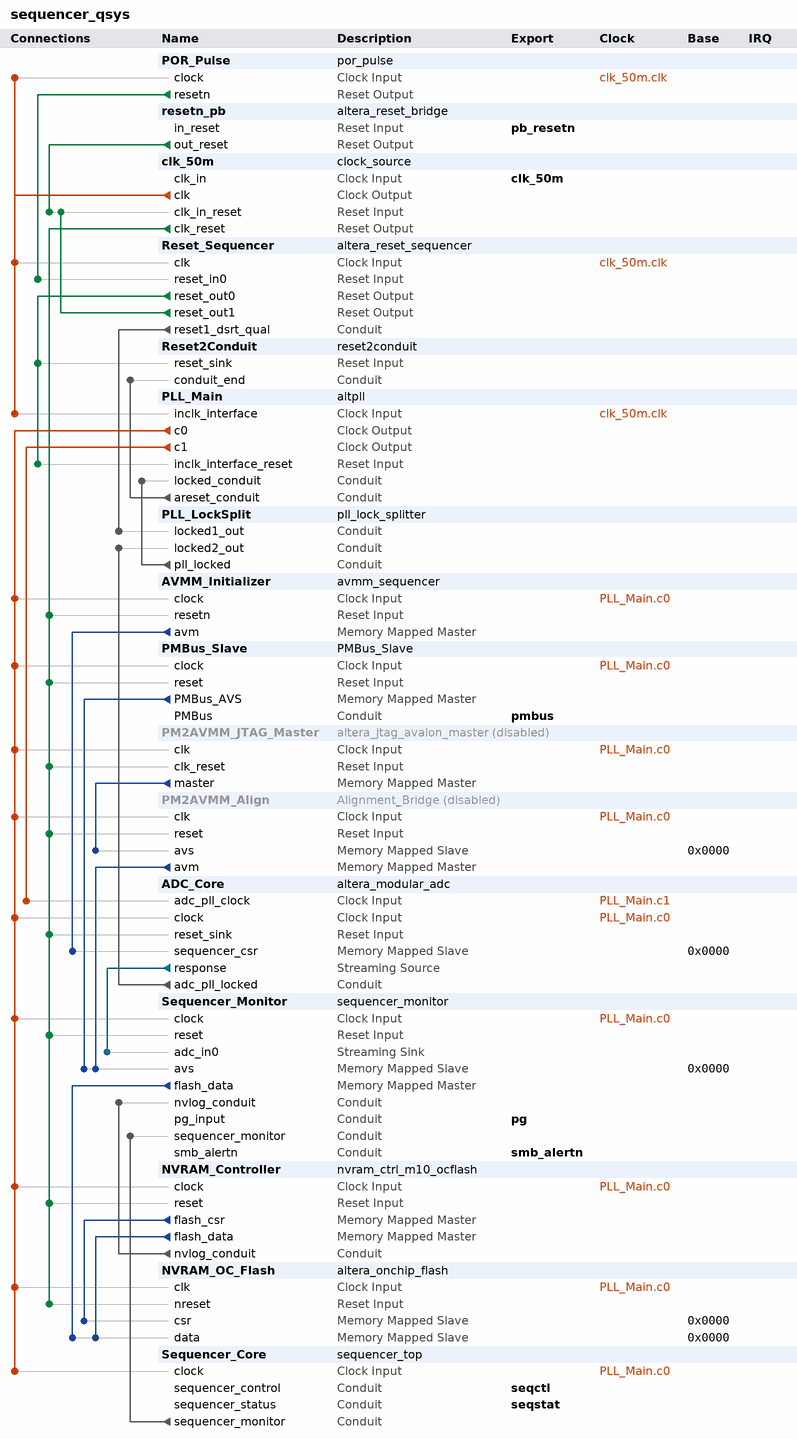
[diagram p0: system contents]
# Platform Designer (Qsys) system sequencer_qsys, MAX 10 10M08SAE144C8G
# Parameters at their usual value, and those the tool derives, are not listed.
package require -exact qsys 25.1
create_system sequencer_qsys
set_project_property DEVICE_FAMILY {MAX 10}
set_project_property DEVICE 10M08SAE144C8G

add_instance POR_Pulse por_pulse 1.0
set_instance_parameter_value POR_Pulse P_WIDTH 16

add_instance resetn_pb altera_reset_bridge 25.1
set_instance_parameter_value resetn_pb ACTIVE_LOW_RESET 1
set_instance_parameter_value resetn_pb SYNCHRONOUS_EDGES none

add_instance clk_50m clock_source 25.1
set_instance_parameter_value clk_50m clockFrequency 50000000

add_instance Reset_Sequencer altera_reset_sequencer 25.1
set_instance_parameter_value Reset_Sequencer ENABLE_CSR 0
set_instance_parameter_value Reset_Sequencer ENABLE_RESET_REQUEST_INPUT 0
set_instance_parameter_value Reset_Sequencer LIST_ASRT_DELAY 0,0,0,0,0,0,0,0,0,0
set_instance_parameter_value Reset_Sequencer LIST_ASRT_SEQ 0,1,2,3,4,5,6,7,8,9
set_instance_parameter_value Reset_Sequencer LIST_DSRT_DELAY 0,128,0,0,0,0,0,0,0,0
set_instance_parameter_value Reset_Sequencer LIST_DSRT_SEQ 0,1,2,3,4,5,6,7,8,9
set_instance_parameter_value Reset_Sequencer MIN_ASRT_TIME 1
set_instance_parameter_value Reset_Sequencer NUM_INPUTS 1
set_instance_parameter_value Reset_Sequencer NUM_OUTPUTS 2
set_instance_parameter_value Reset_Sequencer USE_DSRT_QUAL 0,1,0,0,0,0,0,0,0,0

add_instance Reset2Conduit reset2conduit 1.0

add_instance PLL_Main altpll 25.1
set_instance_parameter_value PLL_Main CLK0_DIVIDE_BY 1
set_instance_parameter_value PLL_Main CLK0_MULTIPLY_BY 1
set_instance_parameter_value PLL_Main CLK1_DIVIDE_BY 5
set_instance_parameter_value PLL_Main CLK1_DUTY_CYCLE 50
set_instance_parameter_value PLL_Main CLK1_MULTIPLY_BY 1
set_instance_parameter_value PLL_Main CLK1_PHASE_SHIFT 0
set_instance_parameter_value PLL_Main INCLK0_INPUT_FREQUENCY 20000
set_instance_parameter_value PLL_Main PORT_ARESET PORT_USED
set_instance_parameter_value PLL_Main PORT_LOCKED PORT_USED
set_instance_parameter_value PLL_Main PORT_clk1 PORT_USED
set_instance_parameter_value PLL_Main PORT_clk2 PORT_UNUSED
set_instance_parameter_value PLL_Main PORT_clk3 PORT_UNUSED

add_instance PLL_LockSplit pll_lock_splitter 1.0

add_instance AVMM_Initializer avmm_sequencer 1.0
set_instance_parameter_value AVMM_Initializer P_ADDRSIZE 8
set_instance_parameter_value AVMM_Initializer P_DATASIZE 32

add_instance PMBus_Slave PMBus_Slave 1.0
set_instance_parameter_value PMBus_Slave MAX_BYTES 4
set_instance_parameter_value PMBus_Slave PMB_SLAVE_ADDR 85

add_instance PM2AVMM_JTAG_Master altera_jtag_avalon_master 25.1
set_instance_property PM2AVMM_JTAG_Master ENABLED false

add_instance PM2AVMM_Align Alignment_Bridge 1.0
set_instance_property PM2AVMM_Align ENABLED false

add_instance ADC_Core altera_modular_adc 25.1
set_instance_parameter_value ADC_Core CLOCK_FREQ 50000000
set_instance_parameter_value ADC_Core CORE_VAR 2
set_instance_parameter_value ADC_Core DEVICE_PART 10M08SAE144C8G
set_instance_parameter_value ADC_Core clkdiv 2
set_instance_parameter_value ADC_Core enable_usr_sim 1
set_instance_parameter_value ADC_Core int_vref_vr 3.3
set_instance_parameter_value ADC_Core refsel 0
set_instance_parameter_value ADC_Core sample_rate 0
set_instance_parameter_value ADC_Core seq_order_length 7
set_instance_parameter_value ADC_Core seq_order_slot_1 1
set_instance_parameter_value ADC_Core seq_order_slot_2 2
set_instance_parameter_value ADC_Core seq_order_slot_3 3
set_instance_parameter_value ADC_Core seq_order_slot_4 4
set_instance_parameter_value ADC_Core seq_order_slot_5 5
set_instance_parameter_value ADC_Core seq_order_slot_6 6
set_instance_parameter_value ADC_Core seq_order_slot_7 8
set_instance_parameter_value ADC_Core seq_order_slot_8 7
set_instance_parameter_value ADC_Core simfilename_ch0 adcsim_ch0.txt
set_instance_parameter_value ADC_Core simfilename_ch1 adcsim_ch1.txt
set_instance_parameter_value ADC_Core simfilename_ch2 adcsim_ch2.txt
set_instance_parameter_value ADC_Core simfilename_ch3 adcsim_ch3.txt
set_instance_parameter_value ADC_Core simfilename_ch4 adcsim_ch4.txt
set_instance_parameter_value ADC_Core simfilename_ch5 adcsim_ch5.txt
set_instance_parameter_value ADC_Core simfilename_ch6 adcsim_ch6.txt
set_instance_parameter_value ADC_Core simfilename_ch7 adcsim_ch7.txt
set_instance_parameter_value ADC_Core simfilename_ch8 adcsim_ch8.txt
set_instance_parameter_value ADC_Core use_ch0 false
set_instance_parameter_value ADC_Core use_ch2 true
set_instance_parameter_value ADC_Core use_ch3 true
set_instance_parameter_value ADC_Core use_ch4 true
set_instance_parameter_value ADC_Core use_ch5 true
set_instance_parameter_value ADC_Core use_ch6 true
set_instance_parameter_value ADC_Core use_ch7 true
set_instance_parameter_value ADC_Core use_ch8 true
set_instance_parameter_value ADC_Core use_tsd false

add_instance Sequencer_Monitor sequencer_monitor 1.0
set_instance_parameter_value Sequencer_Monitor ADC_CHANNEL_IFNUM 1,1,1,1,1,1,PG_Input,PG_Input,PG_Input,PG_Input,PG_Input,PG_Input,PG_Input,PG_Input,PG_Input,PG_Input,PG_Input,PG_Input,PG_Input,PG_Input,PG_Input,PG_Input,PG_Input,PG_Input,PG_Input,PG_Input,PG_Input,PG_Input,PG_Input,PG_Input,PG_Input,PG_Input,PG_Input,PG_Input,PG_Input,PG_Input,PG_Input,PG_Input,PG_Input,PG_Input,PG_Input,PG_Input,PG_Input,PG_Input,PG_Input,PG_Input,PG_Input,PG_Input,PG_Input,PG_Input,PG_Input,PG_Input,PG_Input,PG_Input,PG_Input,PG_Input,PG_Input,PG_Input,PG_Input,PG_Input,PG_Input,PG_Input,PG_Input,PG_Input,PG_Input,PG_Input,PG_Input,PG_Input,PG_Input,PG_Input,PG_Input,PG_Input,PG_Input,PG_Input,PG_Input,PG_Input,PG_Input,PG_Input,PG_Input,PG_Input,PG_Input,PG_Input,PG_Input,PG_Input,PG_Input,PG_Input,PG_Input,PG_Input,PG_Input,PG_Input,PG_Input,PG_Input,PG_Input,PG_Input,PG_Input,PG_Input,PG_Input,PG_Input,PG_Input,PG_Input,PG_Input,PG_Input,PG_Input,PG_Input,PG_Input,PG_Input,PG_Input,PG_Input,PG_Input,PG_Input,PG_Input,PG_Input,PG_Input,PG_Input,PG_Input,PG_Input,PG_Input,PG_Input,PG_Input,PG_Input,PG_Input,PG_Input,PG_Input,PG_Input,PG_Input,PG_Input,PG_Input,PG_Input,PG_Input,PG_Input,PG_Input,PG_Input,PG_Input,PG_Input,PG_Input,PG_Input,PG_Input,PG_Input,PG_Input,PG_Input,PG_Input,PG_Input,PG_Input
set_instance_parameter_value Sequencer_Monitor ADC_CHANNEL_VOUTNUM 2,3,4,5,6,8,0,0,0,0,0,0,0,0,0,0,0,0,0,0,0,0,0,0,0,0,0,0,0,0,0,0,0,0,0,0,0,0,0,0,0,0,0,0,0,0,0,0,0,0,0,0,0,0,0,0,0,0,0,0,0,0,0,0,0,0,0,0,0,0,0,0,0,0,0,0,0,0,0,0,0,0,0,0,0,0,0,0,0,0,0,0,0,0,0,0,0,0,0,0,0,0,0,0,0,0,0,0,0,0,0,0,0,0,0,0,0,0,0,0,0,0,0,0,0,0,0,0,0,0,0,0,0,0,0,0,0,0,0,0,0,0,0
set_instance_parameter_value Sequencer_Monitor ADC_IFNUM 1
set_instance_parameter_value Sequencer_Monitor ADC_SAMPLES 3
set_instance_parameter_value Sequencer_Monitor ADC_VREF 2.5
set_instance_parameter_value Sequencer_Monitor CLOCK_RATE_CLK 50000000
set_instance_parameter_value Sequencer_Monitor COMPOSED_MONITOR 1
set_instance_parameter_value Sequencer_Monitor FEATURE_LEVEL 2
set_instance_parameter_value Sequencer_Monitor LOGGING_ENA 0
set_instance_parameter_value Sequencer_Monitor LOGGING_LEVEL 2
set_instance_parameter_value Sequencer_Monitor NV_AWIDTH 17
set_instance_parameter_value Sequencer_Monitor PG_DEBOUNCE 10
set_instance_parameter_value Sequencer_Monitor PG_NUM 7
set_instance_parameter_value Sequencer_Monitor RETRY_ATTEMPTS 3
set_instance_parameter_value Sequencer_Monitor RETRY_TIMEOUT 1
set_instance_parameter_value Sequencer_Monitor T_REQUIRE_WE_FOR_CLR false
set_instance_parameter_value Sequencer_Monitor VIN_ADC_CHANNEL 1
set_instance_parameter_value Sequencer_Monitor VIN_ADC_IFNUM 1
set_instance_parameter_value Sequencer_Monitor VIN_OFF 90.0
set_instance_parameter_value Sequencer_Monitor VIN_ON 95.0
set_instance_parameter_value Sequencer_Monitor VIN_OVF 107.0
set_instance_parameter_value Sequencer_Monitor VIN_OVRSP true
set_instance_parameter_value Sequencer_Monitor VIN_OVW 105.0
set_instance_parameter_value Sequencer_Monitor VIN_TYP 1.65
set_instance_parameter_value Sequencer_Monitor VIN_UVF 93.0
set_instance_parameter_value Sequencer_Monitor VIN_UVRSP true
set_instance_parameter_value Sequencer_Monitor VIN_UVW 97.0
set_instance_parameter_value Sequencer_Monitor VOUT0_OFF 90.0
set_instance_parameter_value Sequencer_Monitor VOUT0_ON 95.0
set_instance_parameter_value Sequencer_Monitor VOUT0_OVF 107.0
set_instance_parameter_value Sequencer_Monitor VOUT0_OVRSP true
set_instance_parameter_value Sequencer_Monitor VOUT0_OVW 105.0
set_instance_parameter_value Sequencer_Monitor VOUT0_TYP 0.6
set_instance_parameter_value Sequencer_Monitor VOUT0_UVF 93.0
set_instance_parameter_value Sequencer_Monitor VOUT0_UVRSP true
set_instance_parameter_value Sequencer_Monitor VOUT0_UVW 97.0
set_instance_parameter_value Sequencer_Monitor VOUT100_OFF 90.0
set_instance_parameter_value Sequencer_Monitor VOUT100_ON 95.0
set_instance_parameter_value Sequencer_Monitor VOUT100_OVF 107.0
set_instance_parameter_value Sequencer_Monitor VOUT100_OVRSP true
set_instance_parameter_value Sequencer_Monitor VOUT100_OVW 105.0
set_instance_parameter_value Sequencer_Monitor VOUT100_TYP 1.5
set_instance_parameter_value Sequencer_Monitor VOUT100_UVF 93.0
set_instance_parameter_value Sequencer_Monitor VOUT100_UVRSP true
set_instance_parameter_value Sequencer_Monitor VOUT100_UVW 97.0
set_instance_parameter_value Sequencer_Monitor VOUT101_OFF 90.0
set_instance_parameter_value Sequencer_Monitor VOUT101_ON 95.0
set_instance_parameter_value Sequencer_Monitor VOUT101_OVF 107.0
set_instance_parameter_value Sequencer_Monitor VOUT101_OVRSP true
set_instance_parameter_value Sequencer_Monitor VOUT101_OVW 105.0
set_instance_parameter_value Sequencer_Monitor VOUT101_TYP 1.5
set_instance_parameter_value Sequencer_Monitor VOUT101_UVF 93.0
set_instance_parameter_value Sequencer_Monitor VOUT101_UVRSP true
set_instance_parameter_value Sequencer_Monitor VOUT101_UVW 97.0
set_instance_parameter_value Sequencer_Monitor VOUT102_OFF 90.0
set_instance_parameter_value Sequencer_Monitor VOUT102_ON 95.0
set_instance_parameter_value Sequencer_Monitor VOUT102_OVF 107.0
set_instance_parameter_value Sequencer_Monitor VOUT102_OVRSP true
set_instance_parameter_value Sequencer_Monitor VOUT102_OVW 105.0
set_instance_parameter_value Sequencer_Monitor VOUT102_TYP 1.5
set_instance_parameter_value Sequencer_Monitor VOUT102_UVF 93.0
set_instance_parameter_value Sequencer_Monitor VOUT102_UVRSP true
set_instance_parameter_value Sequencer_Monitor VOUT102_UVW 97.0
set_instance_parameter_value Sequencer_Monitor VOUT103_OFF 90.0
set_instance_parameter_value Sequencer_Monitor VOUT103_ON 95.0
set_instance_parameter_value Sequencer_Monitor VOUT103_OVF 107.0
set_instance_parameter_value Sequencer_Monitor VOUT103_OVRSP true
set_instance_parameter_value Sequencer_Monitor VOUT103_OVW 105.0
set_instance_parameter_value Sequencer_Monitor VOUT103_TYP 1.5
set_instance_parameter_value Sequencer_Monitor VOUT103_UVF 93.0
set_instance_parameter_value Sequencer_Monitor VOUT103_UVRSP true
set_instance_parameter_value Sequencer_Monitor VOUT103_UVW 97.0
set_instance_parameter_value Sequencer_Monitor VOUT104_OFF 90.0
set_instance_parameter_value Sequencer_Monitor VOUT104_ON 95.0
set_instance_parameter_value Sequencer_Monitor VOUT104_OVF 107.0
set_instance_parameter_value Sequencer_Monitor VOUT104_OVRSP true
set_instance_parameter_value Sequencer_Monitor VOUT104_OVW 105.0
set_instance_parameter_value Sequencer_Monitor VOUT104_TYP 1.5
set_instance_parameter_value Sequencer_Monitor VOUT104_UVF 93.0
set_instance_parameter_value Sequencer_Monitor VOUT104_UVRSP true
set_instance_parameter_value Sequencer_Monitor VOUT104_UVW 97.0
set_instance_parameter_value Sequencer_Monitor VOUT105_OFF 90.0
set_instance_parameter_value Sequencer_Monitor VOUT105_ON 95.0
set_instance_parameter_value Sequencer_Monitor VOUT105_OVF 107.0
set_instance_parameter_value Sequencer_Monitor VOUT105_OVRSP true
set_instance_parameter_value Sequencer_Monitor VOUT105_OVW 105.0
set_instance_parameter_value Sequencer_Monitor VOUT105_TYP 1.5
set_instance_parameter_value Sequencer_Monitor VOUT105_UVF 93.0
set_instance_parameter_value Sequencer_Monitor VOUT105_UVRSP true
set_instance_parameter_value Sequencer_Monitor VOUT105_UVW 97.0
set_instance_parameter_value Sequencer_Monitor VOUT106_OFF 90.0
set_instance_parameter_value Sequencer_Monitor VOUT106_ON 95.0
set_instance_parameter_value Sequencer_Monitor VOUT106_OVF 107.0
set_instance_parameter_value Sequencer_Monitor VOUT106_OVRSP true
set_instance_parameter_value Sequencer_Monitor VOUT106_OVW 105.0
set_instance_parameter_value Sequencer_Monitor VOUT106_TYP 1.5
set_instance_parameter_value Sequencer_Monitor VOUT106_UVF 93.0
set_instance_parameter_value Sequencer_Monitor VOUT106_UVRSP true
set_instance_parameter_value Sequencer_Monitor VOUT106_UVW 97.0
set_instance_parameter_value Sequencer_Monitor VOUT107_OFF 90.0
set_instance_parameter_value Sequencer_Monitor VOUT107_ON 95.0
set_instance_parameter_value Sequencer_Monitor VOUT107_OVF 107.0
set_instance_parameter_value Sequencer_Monitor VOUT107_OVRSP true
set_instance_parameter_value Sequencer_Monitor VOUT107_OVW 105.0
set_instance_parameter_value Sequencer_Monitor VOUT107_TYP 1.5
set_instance_parameter_value Sequencer_Monitor VOUT107_UVF 93.0
set_instance_parameter_value Sequencer_Monitor VOUT107_UVRSP true
set_instance_parameter_value Sequencer_Monitor VOUT107_UVW 97.0
set_instance_parameter_value Sequencer_Monitor VOUT108_OFF 90.0
set_instance_parameter_value Sequencer_Monitor VOUT108_ON 95.0
set_instance_parameter_value Sequencer_Monitor VOUT108_OVF 107.0
set_instance_parameter_value Sequencer_Monitor VOUT108_OVRSP true
set_instance_parameter_value Sequencer_Monitor VOUT108_OVW 105.0
set_instance_parameter_value Sequencer_Monitor VOUT108_TYP 1.5
set_instance_parameter_value Sequencer_Monitor VOUT108_UVF 93.0
set_instance_parameter_value Sequencer_Monitor VOUT108_UVRSP true
set_instance_parameter_value Sequencer_Monitor VOUT108_UVW 97.0
set_instance_parameter_value Sequencer_Monitor VOUT109_OFF 90.0
set_instance_parameter_value Sequencer_Monitor VOUT109_ON 95.0
set_instance_parameter_value Sequencer_Monitor VOUT109_OVF 107.0
set_instance_parameter_value Sequencer_Monitor VOUT109_OVRSP true
set_instance_parameter_value Sequencer_Monitor VOUT109_OVW 105.0
set_instance_parameter_value Sequencer_Monitor VOUT109_TYP 1.5
set_instance_parameter_value Sequencer_Monitor VOUT109_UVF 93.0
set_instance_parameter_value Sequencer_Monitor VOUT109_UVRSP true
set_instance_parameter_value Sequencer_Monitor VOUT109_UVW 97.0
set_instance_parameter_value Sequencer_Monitor VOUT10_OFF 90.0
set_instance_parameter_value Sequencer_Monitor VOUT10_ON 95.0
set_instance_parameter_value Sequencer_Monitor VOUT10_OVF 107.0
set_instance_parameter_value Sequencer_Monitor VOUT10_OVRSP true
set_instance_parameter_value Sequencer_Monitor VOUT10_OVW 105.0
set_instance_parameter_value Sequencer_Monitor VOUT10_TYP 1.5
set_instance_parameter_value Sequencer_Monitor VOUT10_UVF 93.0
set_instance_parameter_value Sequencer_Monitor VOUT10_UVRSP true
set_instance_parameter_value Sequencer_Monitor VOUT10_UVW 97.0
set_instance_parameter_value Sequencer_Monitor VOUT110_OFF 90.0
set_instance_parameter_value Sequencer_Monitor VOUT110_ON 95.0
set_instance_parameter_value Sequencer_Monitor VOUT110_OVF 107.0
set_instance_parameter_value Sequencer_Monitor VOUT110_OVRSP true
set_instance_parameter_value Sequencer_Monitor VOUT110_OVW 105.0
set_instance_parameter_value Sequencer_Monitor VOUT110_TYP 1.5
set_instance_parameter_value Sequencer_Monitor VOUT110_UVF 93.0
set_instance_parameter_value Sequencer_Monitor VOUT110_UVRSP true
set_instance_parameter_value Sequencer_Monitor VOUT110_UVW 97.0
set_instance_parameter_value Sequencer_Monitor VOUT111_OFF 90.0
set_instance_parameter_value Sequencer_Monitor VOUT111_ON 95.0
set_instance_parameter_value Sequencer_Monitor VOUT111_OVF 107.0
set_instance_parameter_value Sequencer_Monitor VOUT111_OVRSP true
set_instance_parameter_value Sequencer_Monitor VOUT111_OVW 105.0
set_instance_parameter_value Sequencer_Monitor VOUT111_TYP 1.5
set_instance_parameter_value Sequencer_Monitor VOUT111_UVF 93.0
set_instance_parameter_value Sequencer_Monitor VOUT111_UVRSP true
set_instance_parameter_value Sequencer_Monitor VOUT111_UVW 97.0
set_instance_parameter_value Sequencer_Monitor VOUT112_OFF 90.0
set_instance_parameter_value Sequencer_Monitor VOUT112_ON 95.0
set_instance_parameter_value Sequencer_Monitor VOUT112_OVF 107.0
set_instance_parameter_value Sequencer_Monitor VOUT112_OVRSP true
set_instance_parameter_value Sequencer_Monitor VOUT112_OVW 105.0
set_instance_parameter_value Sequencer_Monitor VOUT112_TYP 1.5
set_instance_parameter_value Sequencer_Monitor VOUT112_UVF 93.0
set_instance_parameter_value Sequencer_Monitor VOUT112_UVRSP true
set_instance_parameter_value Sequencer_Monitor VOUT112_UVW 97.0
set_instance_parameter_value Sequencer_Monitor VOUT113_OFF 90.0
set_instance_parameter_value Sequencer_Monitor VOUT113_ON 95.0
set_instance_parameter_value Sequencer_Monitor VOUT113_OVF 107.0
set_instance_parameter_value Sequencer_Monitor VOUT113_OVRSP true
set_instance_parameter_value Sequencer_Monitor VOUT113_OVW 105.0
set_instance_parameter_value Sequencer_Monitor VOUT113_TYP 1.5
set_instance_parameter_value Sequencer_Monitor VOUT113_UVF 93.0
set_instance_parameter_value Sequencer_Monitor VOUT113_UVRSP true
set_instance_parameter_value Sequencer_Monitor VOUT113_UVW 97.0
set_instance_parameter_value Sequencer_Monitor VOUT114_OFF 90.0
set_instance_parameter_value Sequencer_Monitor VOUT114_ON 95.0
set_instance_parameter_value Sequencer_Monitor VOUT114_OVF 107.0
set_instance_parameter_value Sequencer_Monitor VOUT114_OVRSP true
set_instance_parameter_value Sequencer_Monitor VOUT114_OVW 105.0
set_instance_parameter_value Sequencer_Monitor VOUT114_TYP 1.5
set_instance_parameter_value Sequencer_Monitor VOUT114_UVF 93.0
set_instance_parameter_value Sequencer_Monitor VOUT114_UVRSP true
set_instance_parameter_value Sequencer_Monitor VOUT114_UVW 97.0
set_instance_parameter_value Sequencer_Monitor VOUT115_OFF 90.0
set_instance_parameter_value Sequencer_Monitor VOUT115_ON 95.0
set_instance_parameter_value Sequencer_Monitor VOUT115_OVF 107.0
set_instance_parameter_value Sequencer_Monitor VOUT115_OVRSP true
set_instance_parameter_value Sequencer_Monitor VOUT115_OVW 105.0
set_instance_parameter_value Sequencer_Monitor VOUT115_TYP 1.5
set_instance_parameter_value Sequencer_Monitor VOUT115_UVF 93.0
set_instance_parameter_value Sequencer_Monitor VOUT115_UVRSP true
set_instance_parameter_value Sequencer_Monitor VOUT115_UVW 97.0
set_instance_parameter_value Sequencer_Monitor VOUT116_OFF 90.0
set_instance_parameter_value Sequencer_Monitor VOUT116_ON 95.0
set_instance_parameter_value Sequencer_Monitor VOUT116_OVF 107.0
set_instance_parameter_value Sequencer_Monitor VOUT116_OVRSP true
set_instance_parameter_value Sequencer_Monitor VOUT116_OVW 105.0
set_instance_parameter_value Sequencer_Monitor VOUT116_TYP 1.5
set_instance_parameter_value Sequencer_Monitor VOUT116_UVF 93.0
set_instance_parameter_value Sequencer_Monitor VOUT116_UVRSP true
set_instance_parameter_value Sequencer_Monitor VOUT116_UVW 97.0
set_instance_parameter_value Sequencer_Monitor VOUT117_OFF 90.0
set_instance_parameter_value Sequencer_Monitor VOUT117_ON 95.0
set_instance_parameter_value Sequencer_Monitor VOUT117_OVF 107.0
set_instance_parameter_value Sequencer_Monitor VOUT117_OVRSP true
set_instance_parameter_value Sequencer_Monitor VOUT117_OVW 105.0
set_instance_parameter_value Sequencer_Monitor VOUT117_TYP 1.5
set_instance_parameter_value Sequencer_Monitor VOUT117_UVF 93.0
set_instance_parameter_value Sequencer_Monitor VOUT117_UVRSP true
set_instance_parameter_value Sequencer_Monitor VOUT117_UVW 97.0
set_instance_parameter_value Sequencer_Monitor VOUT118_OFF 90.0
set_instance_parameter_value Sequencer_Monitor VOUT118_ON 95.0
set_instance_parameter_value Sequencer_Monitor VOUT118_OVF 107.0
set_instance_parameter_value Sequencer_Monitor VOUT118_OVRSP true
set_instance_parameter_value Sequencer_Monitor VOUT118_OVW 105.0
set_instance_parameter_value Sequencer_Monitor VOUT118_TYP 1.5
set_instance_parameter_value Sequencer_Monitor VOUT118_UVF 93.0
set_instance_parameter_value Sequencer_Monitor VOUT118_UVRSP true
set_instance_parameter_value Sequencer_Monitor VOUT118_UVW 97.0
set_instance_parameter_value Sequencer_Monitor VOUT119_OFF 90.0
set_instance_parameter_value Sequencer_Monitor VOUT119_ON 95.0
set_instance_parameter_value Sequencer_Monitor VOUT119_OVF 107.0
set_instance_parameter_value Sequencer_Monitor VOUT119_OVRSP true
set_instance_parameter_value Sequencer_Monitor VOUT119_OVW 105.0
set_instance_parameter_value Sequencer_Monitor VOUT119_TYP 1.5
set_instance_parameter_value Sequencer_Monitor VOUT119_UVF 93.0
set_instance_parameter_value Sequencer_Monitor VOUT119_UVRSP true
set_instance_parameter_value Sequencer_Monitor VOUT119_UVW 97.0
set_instance_parameter_value Sequencer_Monitor VOUT11_OFF 90.0
set_instance_parameter_value Sequencer_Monitor VOUT11_ON 95.0
set_instance_parameter_value Sequencer_Monitor VOUT11_OVF 107.0
set_instance_parameter_value Sequencer_Monitor VOUT11_OVRSP true
set_instance_parameter_value Sequencer_Monitor VOUT11_OVW 105.0
set_instance_parameter_value Sequencer_Monitor VOUT11_TYP 1.5
set_instance_parameter_value Sequencer_Monitor VOUT11_UVF 93.0
set_instance_parameter_value Sequencer_Monitor VOUT11_UVRSP true
set_instance_parameter_value Sequencer_Monitor VOUT11_UVW 97.0
set_instance_parameter_value Sequencer_Monitor VOUT120_OFF 90.0
set_instance_parameter_value Sequencer_Monitor VOUT120_ON 95.0
set_instance_parameter_value Sequencer_Monitor VOUT120_OVF 107.0
set_instance_parameter_value Sequencer_Monitor VOUT120_OVRSP true
set_instance_parameter_value Sequencer_Monitor VOUT120_OVW 105.0
set_instance_parameter_value Sequencer_Monitor VOUT120_TYP 1.5
set_instance_parameter_value Sequencer_Monitor VOUT120_UVF 93.0
set_instance_parameter_value Sequencer_Monitor VOUT120_UVRSP true
set_instance_parameter_value Sequencer_Monitor VOUT120_UVW 97.0
set_instance_parameter_value Sequencer_Monitor VOUT121_OFF 90.0
set_instance_parameter_value Sequencer_Monitor VOUT121_ON 95.0
set_instance_parameter_value Sequencer_Monitor VOUT121_OVF 107.0
set_instance_parameter_value Sequencer_Monitor VOUT121_OVRSP true
set_instance_parameter_value Sequencer_Monitor VOUT121_OVW 105.0
set_instance_parameter_value Sequencer_Monitor VOUT121_TYP 1.5
set_instance_parameter_value Sequencer_Monitor VOUT121_UVF 93.0
set_instance_parameter_value Sequencer_Monitor VOUT121_UVRSP true
set_instance_parameter_value Sequencer_Monitor VOUT121_UVW 97.0
set_instance_parameter_value Sequencer_Monitor VOUT122_OFF 90.0
set_instance_parameter_value Sequencer_Monitor VOUT122_ON 95.0
set_instance_parameter_value Sequencer_Monitor VOUT122_OVF 107.0
set_instance_parameter_value Sequencer_Monitor VOUT122_OVRSP true
set_instance_parameter_value Sequencer_Monitor VOUT122_OVW 105.0
set_instance_parameter_value Sequencer_Monitor VOUT122_TYP 1.5
set_instance_parameter_value Sequencer_Monitor VOUT122_UVF 93.0
set_instance_parameter_value Sequencer_Monitor VOUT122_UVRSP true
set_instance_parameter_value Sequencer_Monitor VOUT122_UVW 97.0
set_instance_parameter_value Sequencer_Monitor VOUT123_OFF 90.0
set_instance_parameter_value Sequencer_Monitor VOUT123_ON 95.0
set_instance_parameter_value Sequencer_Monitor VOUT123_OVF 107.0
set_instance_parameter_value Sequencer_Monitor VOUT123_OVRSP true
set_instance_parameter_value Sequencer_Monitor VOUT123_OVW 105.0
set_instance_parameter_value Sequencer_Monitor VOUT123_TYP 1.5
set_instance_parameter_value Sequencer_Monitor VOUT123_UVF 93.0
set_instance_parameter_value Sequencer_Monitor VOUT123_UVRSP true
set_instance_parameter_value Sequencer_Monitor VOUT123_UVW 97.0
set_instance_parameter_value Sequencer_Monitor VOUT124_OFF 90.0
set_instance_parameter_value Sequencer_Monitor VOUT124_ON 95.0
set_instance_parameter_value Sequencer_Monitor VOUT124_OVF 107.0
set_instance_parameter_value Sequencer_Monitor VOUT124_OVRSP true
set_instance_parameter_value Sequencer_Monitor VOUT124_OVW 105.0
set_instance_parameter_value Sequencer_Monitor VOUT124_TYP 1.5
set_instance_parameter_value Sequencer_Monitor VOUT124_UVF 93.0
set_instance_parameter_value Sequencer_Monitor VOUT124_UVRSP true
set_instance_parameter_value Sequencer_Monitor VOUT124_UVW 97.0
set_instance_parameter_value Sequencer_Monitor VOUT125_OFF 90.0
set_instance_parameter_value Sequencer_Monitor VOUT125_ON 95.0
set_instance_parameter_value Sequencer_Monitor VOUT125_OVF 107.0
set_instance_parameter_value Sequencer_Monitor VOUT125_OVRSP true
set_instance_parameter_value Sequencer_Monitor VOUT125_OVW 105.0
set_instance_parameter_value Sequencer_Monitor VOUT125_TYP 1.5
set_instance_parameter_value Sequencer_Monitor VOUT125_UVF 93.0
set_instance_parameter_value Sequencer_Monitor VOUT125_UVRSP true
set_instance_parameter_value Sequencer_Monitor VOUT125_UVW 97.0
set_instance_parameter_value Sequencer_Monitor VOUT126_OFF 90.0
set_instance_parameter_value Sequencer_Monitor VOUT126_ON 95.0
set_instance_parameter_value Sequencer_Monitor VOUT126_OVF 107.0
set_instance_parameter_value Sequencer_Monitor VOUT126_OVRSP true
set_instance_parameter_value Sequencer_Monitor VOUT126_OVW 105.0
set_instance_parameter_value Sequencer_Monitor VOUT126_TYP 1.5
set_instance_parameter_value Sequencer_Monitor VOUT126_UVF 93.0
set_instance_parameter_value Sequencer_Monitor VOUT126_UVRSP true
set_instance_parameter_value Sequencer_Monitor VOUT126_UVW 97.0
set_instance_parameter_value Sequencer_Monitor VOUT127_OFF 90.0
set_instance_parameter_value Sequencer_Monitor VOUT127_ON 95.0
set_instance_parameter_value Sequencer_Monitor VOUT127_OVF 107.0
set_instance_parameter_value Sequencer_Monitor VOUT127_OVRSP true
set_instance_parameter_value Sequencer_Monitor VOUT127_OVW 105.0
set_instance_parameter_value Sequencer_Monitor VOUT127_TYP 1.5
set_instance_parameter_value Sequencer_Monitor VOUT127_UVF 93.0
set_instance_parameter_value Sequencer_Monitor VOUT127_UVRSP true
set_instance_parameter_value Sequencer_Monitor VOUT127_UVW 97.0
set_instance_parameter_value Sequencer_Monitor VOUT128_OFF 90.0
set_instance_parameter_value Sequencer_Monitor VOUT128_ON 95.0
set_instance_parameter_value Sequencer_Monitor VOUT128_OVF 107.0
set_instance_parameter_value Sequencer_Monitor VOUT128_OVRSP true
set_instance_parameter_value Sequencer_Monitor VOUT128_OVW 105.0
set_instance_parameter_value Sequencer_Monitor VOUT128_TYP 1.5
set_instance_parameter_value Sequencer_Monitor VOUT128_UVF 93.0
set_instance_parameter_value Sequencer_Monitor VOUT128_UVRSP true
set_instance_parameter_value Sequencer_Monitor VOUT128_UVW 97.0
set_instance_parameter_value Sequencer_Monitor VOUT129_OFF 90.0
set_instance_parameter_value Sequencer_Monitor VOUT129_ON 95.0
set_instance_parameter_value Sequencer_Monitor VOUT129_OVF 107.0
set_instance_parameter_value Sequencer_Monitor VOUT129_OVRSP true
set_instance_parameter_value Sequencer_Monitor VOUT129_OVW 105.0
set_instance_parameter_value Sequencer_Monitor VOUT129_TYP 1.5
set_instance_parameter_value Sequencer_Monitor VOUT129_UVF 93.0
set_instance_parameter_value Sequencer_Monitor VOUT129_UVRSP true
set_instance_parameter_value Sequencer_Monitor VOUT129_UVW 97.0
set_instance_parameter_value Sequencer_Monitor VOUT12_OFF 90.0
set_instance_parameter_value Sequencer_Monitor VOUT12_ON 95.0
set_instance_parameter_value Sequencer_Monitor VOUT12_OVF 107.0
set_instance_parameter_value Sequencer_Monitor VOUT12_OVRSP true
set_instance_parameter_value Sequencer_Monitor VOUT12_OVW 105.0
set_instance_parameter_value Sequencer_Monitor VOUT12_TYP 1.5
set_instance_parameter_value Sequencer_Monitor VOUT12_UVF 93.0
set_instance_parameter_value Sequencer_Monitor VOUT12_UVRSP true
set_instance_parameter_value Sequencer_Monitor VOUT12_UVW 97.0
set_instance_parameter_value Sequencer_Monitor VOUT130_OFF 90.0
set_instance_parameter_value Sequencer_Monitor VOUT130_ON 95.0
set_instance_parameter_value Sequencer_Monitor VOUT130_OVF 107.0
set_instance_parameter_value Sequencer_Monitor VOUT130_OVRSP true
set_instance_parameter_value Sequencer_Monitor VOUT130_OVW 105.0
set_instance_parameter_value Sequencer_Monitor VOUT130_TYP 1.5
set_instance_parameter_value Sequencer_Monitor VOUT130_UVF 93.0
set_instance_parameter_value Sequencer_Monitor VOUT130_UVRSP true
set_instance_parameter_value Sequencer_Monitor VOUT130_UVW 97.0
set_instance_parameter_value Sequencer_Monitor VOUT131_OFF 90.0
set_instance_parameter_value Sequencer_Monitor VOUT131_ON 95.0
set_instance_parameter_value Sequencer_Monitor VOUT131_OVF 107.0
set_instance_parameter_value Sequencer_Monitor VOUT131_OVRSP true
set_instance_parameter_value Sequencer_Monitor VOUT131_OVW 105.0
set_instance_parameter_value Sequencer_Monitor VOUT131_TYP 1.5
set_instance_parameter_value Sequencer_Monitor VOUT131_UVF 93.0
set_instance_parameter_value Sequencer_Monitor VOUT131_UVRSP true
set_instance_parameter_value Sequencer_Monitor VOUT131_UVW 97.0
set_instance_parameter_value Sequencer_Monitor VOUT132_OFF 90.0
set_instance_parameter_value Sequencer_Monitor VOUT132_ON 95.0
set_instance_parameter_value Sequencer_Monitor VOUT132_OVF 107.0
set_instance_parameter_value Sequencer_Monitor VOUT132_OVRSP true
set_instance_parameter_value Sequencer_Monitor VOUT132_OVW 105.0
set_instance_parameter_value Sequencer_Monitor VOUT132_TYP 1.5
set_instance_parameter_value Sequencer_Monitor VOUT132_UVF 93.0
set_instance_parameter_value Sequencer_Monitor VOUT132_UVRSP true
set_instance_parameter_value Sequencer_Monitor VOUT132_UVW 97.0
set_instance_parameter_value Sequencer_Monitor VOUT133_OFF 90.0
set_instance_parameter_value Sequencer_Monitor VOUT133_ON 95.0
set_instance_parameter_value Sequencer_Monitor VOUT133_OVF 107.0
set_instance_parameter_value Sequencer_Monitor VOUT133_OVRSP true
set_instance_parameter_value Sequencer_Monitor VOUT133_OVW 105.0
set_instance_parameter_value Sequencer_Monitor VOUT133_TYP 1.5
set_instance_parameter_value Sequencer_Monitor VOUT133_UVF 93.0
set_instance_parameter_value Sequencer_Monitor VOUT133_UVRSP true
set_instance_parameter_value Sequencer_Monitor VOUT133_UVW 97.0
set_instance_parameter_value Sequencer_Monitor VOUT134_OFF 90.0
set_instance_parameter_value Sequencer_Monitor VOUT134_ON 95.0
set_instance_parameter_value Sequencer_Monitor VOUT134_OVF 107.0
set_instance_parameter_value Sequencer_Monitor VOUT134_OVRSP true
set_instance_parameter_value Sequencer_Monitor VOUT134_OVW 105.0
set_instance_parameter_value Sequencer_Monitor VOUT134_TYP 1.5
set_instance_parameter_value Sequencer_Monitor VOUT134_UVF 93.0
set_instance_parameter_value Sequencer_Monitor VOUT134_UVRSP true
set_instance_parameter_value Sequencer_Monitor VOUT134_UVW 97.0
set_instance_parameter_value Sequencer_Monitor VOUT135_OFF 90.0
set_instance_parameter_value Sequencer_Monitor VOUT135_ON 95.0
set_instance_parameter_value Sequencer_Monitor VOUT135_OVF 107.0
set_instance_parameter_value Sequencer_Monitor VOUT135_OVRSP true
set_instance_parameter_value Sequencer_Monitor VOUT135_OVW 105.0
set_instance_parameter_value Sequencer_Monitor VOUT135_TYP 1.5
set_instance_parameter_value Sequencer_Monitor VOUT135_UVF 93.0
set_instance_parameter_value Sequencer_Monitor VOUT135_UVRSP true
set_instance_parameter_value Sequencer_Monitor VOUT135_UVW 97.0
set_instance_parameter_value Sequencer_Monitor VOUT136_OFF 90.0
set_instance_parameter_value Sequencer_Monitor VOUT136_ON 95.0
set_instance_parameter_value Sequencer_Monitor VOUT136_OVF 107.0
set_instance_parameter_value Sequencer_Monitor VOUT136_OVRSP true
set_instance_parameter_value Sequencer_Monitor VOUT136_OVW 105.0
set_instance_parameter_value Sequencer_Monitor VOUT136_TYP 1.5
set_instance_parameter_value Sequencer_Monitor VOUT136_UVF 93.0
set_instance_parameter_value Sequencer_Monitor VOUT136_UVRSP true
set_instance_parameter_value Sequencer_Monitor VOUT136_UVW 97.0
set_instance_parameter_value Sequencer_Monitor VOUT137_OFF 90.0
set_instance_parameter_value Sequencer_Monitor VOUT137_ON 95.0
set_instance_parameter_value Sequencer_Monitor VOUT137_OVF 107.0
set_instance_parameter_value Sequencer_Monitor VOUT137_OVRSP true
set_instance_parameter_value Sequencer_Monitor VOUT137_OVW 105.0
set_instance_parameter_value Sequencer_Monitor VOUT137_TYP 1.5
set_instance_parameter_value Sequencer_Monitor VOUT137_UVF 93.0
set_instance_parameter_value Sequencer_Monitor VOUT137_UVRSP true
set_instance_parameter_value Sequencer_Monitor VOUT137_UVW 97.0
set_instance_parameter_value Sequencer_Monitor VOUT138_OFF 90.0
set_instance_parameter_value Sequencer_Monitor VOUT138_ON 95.0
set_instance_parameter_value Sequencer_Monitor VOUT138_OVF 107.0
set_instance_parameter_value Sequencer_Monitor VOUT138_OVRSP true
set_instance_parameter_value Sequencer_Monitor VOUT138_OVW 105.0
set_instance_parameter_value Sequencer_Monitor VOUT138_TYP 1.5
set_instance_parameter_value Sequencer_Monitor VOUT138_UVF 93.0
set_instance_parameter_value Sequencer_Monitor VOUT138_UVRSP true
set_instance_parameter_value Sequencer_Monitor VOUT138_UVW 97.0
set_instance_parameter_value Sequencer_Monitor VOUT139_OFF 90.0
set_instance_parameter_value Sequencer_Monitor VOUT139_ON 95.0
set_instance_parameter_value Sequencer_Monitor VOUT139_OVF 107.0
set_instance_parameter_value Sequencer_Monitor VOUT139_OVRSP true
set_instance_parameter_value Sequencer_Monitor VOUT139_OVW 105.0
set_instance_parameter_value Sequencer_Monitor VOUT139_TYP 1.5
set_instance_parameter_value Sequencer_Monitor VOUT139_UVF 93.0
set_instance_parameter_value Sequencer_Monitor VOUT139_UVRSP true
set_instance_parameter_value Sequencer_Monitor VOUT139_UVW 97.0
set_instance_parameter_value Sequencer_Monitor VOUT13_OFF 90.0
set_instance_parameter_value Sequencer_Monitor VOUT13_ON 95.0
set_instance_parameter_value Sequencer_Monitor VOUT13_OVF 107.0
set_instance_parameter_value Sequencer_Monitor VOUT13_OVRSP true
set_instance_parameter_value Sequencer_Monitor VOUT13_OVW 105.0
set_instance_parameter_value Sequencer_Monitor VOUT13_TYP 1.5
set_instance_parameter_value Sequencer_Monitor VOUT13_UVF 93.0
set_instance_parameter_value Sequencer_Monitor VOUT13_UVRSP true
set_instance_parameter_value Sequencer_Monitor VOUT13_UVW 97.0
set_instance_parameter_value Sequencer_Monitor VOUT140_OFF 90.0
set_instance_parameter_value Sequencer_Monitor VOUT140_ON 95.0
set_instance_parameter_value Sequencer_Monitor VOUT140_OVF 107.0
set_instance_parameter_value Sequencer_Monitor VOUT140_OVRSP true
set_instance_parameter_value Sequencer_Monitor VOUT140_OVW 105.0
set_instance_parameter_value Sequencer_Monitor VOUT140_TYP 1.5
set_instance_parameter_value Sequencer_Monitor VOUT140_UVF 93.0
set_instance_parameter_value Sequencer_Monitor VOUT140_UVRSP true
set_instance_parameter_value Sequencer_Monitor VOUT140_UVW 97.0
set_instance_parameter_value Sequencer_Monitor VOUT141_OFF 90.0
set_instance_parameter_value Sequencer_Monitor VOUT141_ON 95.0
set_instance_parameter_value Sequencer_Monitor VOUT141_OVF 107.0
set_instance_parameter_value Sequencer_Monitor VOUT141_OVRSP true
set_instance_parameter_value Sequencer_Monitor VOUT141_OVW 105.0
set_instance_parameter_value Sequencer_Monitor VOUT141_TYP 1.5
set_instance_parameter_value Sequencer_Monitor VOUT141_UVF 93.0
set_instance_parameter_value Sequencer_Monitor VOUT141_UVRSP true
set_instance_parameter_value Sequencer_Monitor VOUT141_UVW 97.0
set_instance_parameter_value Sequencer_Monitor VOUT142_OFF 90.0
set_instance_parameter_value Sequencer_Monitor VOUT142_ON 95.0
set_instance_parameter_value Sequencer_Monitor VOUT142_OVF 107.0
set_instance_parameter_value Sequencer_Monitor VOUT142_OVRSP true
set_instance_parameter_value Sequencer_Monitor VOUT142_OVW 105.0
set_instance_parameter_value Sequencer_Monitor VOUT142_TYP 1.5
set_instance_parameter_value Sequencer_Monitor VOUT142_UVF 93.0
set_instance_parameter_value Sequencer_Monitor VOUT142_UVRSP true
set_instance_parameter_value Sequencer_Monitor VOUT142_UVW 97.0
set_instance_parameter_value Sequencer_Monitor VOUT14_OFF 90.0
set_instance_parameter_value Sequencer_Monitor VOUT14_ON 95.0
set_instance_parameter_value Sequencer_Monitor VOUT14_OVF 107.0
set_instance_parameter_value Sequencer_Monitor VOUT14_OVRSP true
set_instance_parameter_value Sequencer_Monitor VOUT14_OVW 105.0
set_instance_parameter_value Sequencer_Monitor VOUT14_TYP 1.5
set_instance_parameter_value Sequencer_Monitor VOUT14_UVF 93.0
set_instance_parameter_value Sequencer_Monitor VOUT14_UVRSP true
set_instance_parameter_value Sequencer_Monitor VOUT14_UVW 97.0
set_instance_parameter_value Sequencer_Monitor VOUT15_OFF 90.0
set_instance_parameter_value Sequencer_Monitor VOUT15_ON 95.0
set_instance_parameter_value Sequencer_Monitor VOUT15_OVF 107.0
set_instance_parameter_value Sequencer_Monitor VOUT15_OVRSP true
set_instance_parameter_value Sequencer_Monitor VOUT15_OVW 105.0
set_instance_parameter_value Sequencer_Monitor VOUT15_TYP 1.5
set_instance_parameter_value Sequencer_Monitor VOUT15_UVF 93.0
set_instance_parameter_value Sequencer_Monitor VOUT15_UVRSP true
set_instance_parameter_value Sequencer_Monitor VOUT15_UVW 97.0
set_instance_parameter_value Sequencer_Monitor VOUT16_OFF 90.0
set_instance_parameter_value Sequencer_Monitor VOUT16_ON 95.0
set_instance_parameter_value Sequencer_Monitor VOUT16_OVF 107.0
set_instance_parameter_value Sequencer_Monitor VOUT16_OVRSP true
set_instance_parameter_value Sequencer_Monitor VOUT16_OVW 105.0
set_instance_parameter_value Sequencer_Monitor VOUT16_TYP 1.5
set_instance_parameter_value Sequencer_Monitor VOUT16_UVF 93.0
set_instance_parameter_value Sequencer_Monitor VOUT16_UVRSP true
set_instance_parameter_value Sequencer_Monitor VOUT16_UVW 97.0
set_instance_parameter_value Sequencer_Monitor VOUT17_OFF 90.0
set_instance_parameter_value Sequencer_Monitor VOUT17_ON 95.0
set_instance_parameter_value Sequencer_Monitor VOUT17_OVF 107.0
set_instance_parameter_value Sequencer_Monitor VOUT17_OVRSP true
set_instance_parameter_value Sequencer_Monitor VOUT17_OVW 105.0
set_instance_parameter_value Sequencer_Monitor VOUT17_TYP 1.5
set_instance_parameter_value Sequencer_Monitor VOUT17_UVF 93.0
set_instance_parameter_value Sequencer_Monitor VOUT17_UVRSP true
set_instance_parameter_value Sequencer_Monitor VOUT17_UVW 97.0
set_instance_parameter_value Sequencer_Monitor VOUT18_OFF 90.0
set_instance_parameter_value Sequencer_Monitor VOUT18_ON 95.0
set_instance_parameter_value Sequencer_Monitor VOUT18_OVF 107.0
set_instance_parameter_value Sequencer_Monitor VOUT18_OVRSP true
set_instance_parameter_value Sequencer_Monitor VOUT18_OVW 105.0
set_instance_parameter_value Sequencer_Monitor VOUT18_TYP 1.5
set_instance_parameter_value Sequencer_Monitor VOUT18_UVF 93.0
set_instance_parameter_value Sequencer_Monitor VOUT18_UVRSP true
set_instance_parameter_value Sequencer_Monitor VOUT18_UVW 97.0
set_instance_parameter_value Sequencer_Monitor VOUT19_OFF 90.0
set_instance_parameter_value Sequencer_Monitor VOUT19_ON 95.0
set_instance_parameter_value Sequencer_Monitor VOUT19_OVF 107.0
set_instance_parameter_value Sequencer_Monitor VOUT19_OVRSP true
set_instance_parameter_value Sequencer_Monitor VOUT19_OVW 105.0
set_instance_parameter_value Sequencer_Monitor VOUT19_TYP 1.5
set_instance_parameter_value Sequencer_Monitor VOUT19_UVF 93.0
set_instance_parameter_value Sequencer_Monitor VOUT19_UVRSP true
set_instance_parameter_value Sequencer_Monitor VOUT19_UVW 97.0
set_instance_parameter_value Sequencer_Monitor VOUT1_OFF 90.0
set_instance_parameter_value Sequencer_Monitor VOUT1_ON 95.0
set_instance_parameter_value Sequencer_Monitor VOUT1_OVF 107.0
set_instance_parameter_value Sequencer_Monitor VOUT1_OVRSP true
set_instance_parameter_value Sequencer_Monitor VOUT1_OVW 105.0
set_instance_parameter_value Sequencer_Monitor VOUT1_TYP 0.6
set_instance_parameter_value Sequencer_Monitor VOUT1_UVF 93.0
set_instance_parameter_value Sequencer_Monitor VOUT1_UVRSP true
set_instance_parameter_value Sequencer_Monitor VOUT1_UVW 97.0
set_instance_parameter_value Sequencer_Monitor VOUT20_OFF 90.0
set_instance_parameter_value Sequencer_Monitor VOUT20_ON 95.0
set_instance_parameter_value Sequencer_Monitor VOUT20_OVF 107.0
set_instance_parameter_value Sequencer_Monitor VOUT20_OVRSP true
set_instance_parameter_value Sequencer_Monitor VOUT20_OVW 105.0
set_instance_parameter_value Sequencer_Monitor VOUT20_TYP 1.5
set_instance_parameter_value Sequencer_Monitor VOUT20_UVF 93.0
set_instance_parameter_value Sequencer_Monitor VOUT20_UVRSP true
set_instance_parameter_value Sequencer_Monitor VOUT20_UVW 97.0
set_instance_parameter_value Sequencer_Monitor VOUT21_OFF 90.0
set_instance_parameter_value Sequencer_Monitor VOUT21_ON 95.0
set_instance_parameter_value Sequencer_Monitor VOUT21_OVF 107.0
set_instance_parameter_value Sequencer_Monitor VOUT21_OVRSP true
set_instance_parameter_value Sequencer_Monitor VOUT21_OVW 105.0
set_instance_parameter_value Sequencer_Monitor VOUT21_TYP 1.5
set_instance_parameter_value Sequencer_Monitor VOUT21_UVF 93.0
set_instance_parameter_value Sequencer_Monitor VOUT21_UVRSP true
set_instance_parameter_value Sequencer_Monitor VOUT21_UVW 97.0
set_instance_parameter_value Sequencer_Monitor VOUT22_OFF 90.0
set_instance_parameter_value Sequencer_Monitor VOUT22_ON 95.0
set_instance_parameter_value Sequencer_Monitor VOUT22_OVF 107.0
set_instance_parameter_value Sequencer_Monitor VOUT22_OVRSP true
set_instance_parameter_value Sequencer_Monitor VOUT22_OVW 105.0
set_instance_parameter_value Sequencer_Monitor VOUT22_TYP 1.5
set_instance_parameter_value Sequencer_Monitor VOUT22_UVF 93.0
set_instance_parameter_value Sequencer_Monitor VOUT22_UVRSP true
set_instance_parameter_value Sequencer_Monitor VOUT22_UVW 97.0
set_instance_parameter_value Sequencer_Monitor VOUT23_OFF 90.0
set_instance_parameter_value Sequencer_Monitor VOUT23_ON 95.0
set_instance_parameter_value Sequencer_Monitor VOUT23_OVF 107.0
set_instance_parameter_value Sequencer_Monitor VOUT23_OVRSP true
set_instance_parameter_value Sequencer_Monitor VOUT23_OVW 105.0
set_instance_parameter_value Sequencer_Monitor VOUT23_TYP 1.5
set_instance_parameter_value Sequencer_Monitor VOUT23_UVF 93.0
set_instance_parameter_value Sequencer_Monitor VOUT23_UVRSP true
set_instance_parameter_value Sequencer_Monitor VOUT23_UVW 97.0
set_instance_parameter_value Sequencer_Monitor VOUT24_OFF 90.0
set_instance_parameter_value Sequencer_Monitor VOUT24_ON 95.0
set_instance_parameter_value Sequencer_Monitor VOUT24_OVF 107.0
set_instance_parameter_value Sequencer_Monitor VOUT24_OVRSP true
set_instance_parameter_value Sequencer_Monitor VOUT24_OVW 105.0
set_instance_parameter_value Sequencer_Monitor VOUT24_TYP 1.5
set_instance_parameter_value Sequencer_Monitor VOUT24_UVF 93.0
set_instance_parameter_value Sequencer_Monitor VOUT24_UVRSP true
set_instance_parameter_value Sequencer_Monitor VOUT24_UVW 97.0
set_instance_parameter_value Sequencer_Monitor VOUT25_OFF 90.0
set_instance_parameter_value Sequencer_Monitor VOUT25_ON 95.0
set_instance_parameter_value Sequencer_Monitor VOUT25_OVF 107.0
set_instance_parameter_value Sequencer_Monitor VOUT25_OVRSP true
set_instance_parameter_value Sequencer_Monitor VOUT25_OVW 105.0
set_instance_parameter_value Sequencer_Monitor VOUT25_TYP 1.5
set_instance_parameter_value Sequencer_Monitor VOUT25_UVF 93.0
set_instance_parameter_value Sequencer_Monitor VOUT25_UVRSP true
set_instance_parameter_value Sequencer_Monitor VOUT25_UVW 97.0
set_instance_parameter_value Sequencer_Monitor VOUT26_OFF 90.0
set_instance_parameter_value Sequencer_Monitor VOUT26_ON 95.0
set_instance_parameter_value Sequencer_Monitor VOUT26_OVF 107.0
set_instance_parameter_value Sequencer_Monitor VOUT26_OVRSP true
set_instance_parameter_value Sequencer_Monitor VOUT26_OVW 105.0
set_instance_parameter_value Sequencer_Monitor VOUT26_TYP 1.5
set_instance_parameter_value Sequencer_Monitor VOUT26_UVF 93.0
set_instance_parameter_value Sequencer_Monitor VOUT26_UVRSP true
set_instance_parameter_value Sequencer_Monitor VOUT26_UVW 97.0
set_instance_parameter_value Sequencer_Monitor VOUT27_OFF 90.0
set_instance_parameter_value Sequencer_Monitor VOUT27_ON 95.0
set_instance_parameter_value Sequencer_Monitor VOUT27_OVF 107.0
set_instance_parameter_value Sequencer_Monitor VOUT27_OVRSP true
set_instance_parameter_value Sequencer_Monitor VOUT27_OVW 105.0
set_instance_parameter_value Sequencer_Monitor VOUT27_TYP 1.5
set_instance_parameter_value Sequencer_Monitor VOUT27_UVF 93.0
set_instance_parameter_value Sequencer_Monitor VOUT27_UVRSP true
set_instance_parameter_value Sequencer_Monitor VOUT27_UVW 97.0
set_instance_parameter_value Sequencer_Monitor VOUT28_OFF 90.0
set_instance_parameter_value Sequencer_Monitor VOUT28_ON 95.0
set_instance_parameter_value Sequencer_Monitor VOUT28_OVF 107.0
set_instance_parameter_value Sequencer_Monitor VOUT28_OVRSP true
set_instance_parameter_value Sequencer_Monitor VOUT28_OVW 105.0
set_instance_parameter_value Sequencer_Monitor VOUT28_TYP 1.5
set_instance_parameter_value Sequencer_Monitor VOUT28_UVF 93.0
set_instance_parameter_value Sequencer_Monitor VOUT28_UVRSP true
set_instance_parameter_value Sequencer_Monitor VOUT28_UVW 97.0
set_instance_parameter_value Sequencer_Monitor VOUT29_OFF 90.0
set_instance_parameter_value Sequencer_Monitor VOUT29_ON 95.0
set_instance_parameter_value Sequencer_Monitor VOUT29_OVF 107.0
set_instance_parameter_value Sequencer_Monitor VOUT29_OVRSP true
set_instance_parameter_value Sequencer_Monitor VOUT29_OVW 105.0
set_instance_parameter_value Sequencer_Monitor VOUT29_TYP 1.5
set_instance_parameter_value Sequencer_Monitor VOUT29_UVF 93.0
set_instance_parameter_value Sequencer_Monitor VOUT29_UVRSP true
set_instance_parameter_value Sequencer_Monitor VOUT29_UVW 97.0
set_instance_parameter_value Sequencer_Monitor VOUT2_OFF 90.0
set_instance_parameter_value Sequencer_Monitor VOUT2_ON 95.0
set_instance_parameter_value Sequencer_Monitor VOUT2_OVF 107.0
set_instance_parameter_value Sequencer_Monitor VOUT2_OVRSP true
set_instance_parameter_value Sequencer_Monitor VOUT2_OVW 105.0
set_instance_parameter_value Sequencer_Monitor VOUT2_TYP 0.6
set_instance_parameter_value Sequencer_Monitor VOUT2_UVF 93.0
set_instance_parameter_value Sequencer_Monitor VOUT2_UVRSP true
set_instance_parameter_value Sequencer_Monitor VOUT2_UVW 97.0
set_instance_parameter_value Sequencer_Monitor VOUT30_OFF 90.0
set_instance_parameter_value Sequencer_Monitor VOUT30_ON 95.0
set_instance_parameter_value Sequencer_Monitor VOUT30_OVF 107.0
set_instance_parameter_value Sequencer_Monitor VOUT30_OVRSP true
set_instance_parameter_value Sequencer_Monitor VOUT30_OVW 105.0
set_instance_parameter_value Sequencer_Monitor VOUT30_TYP 1.5
set_instance_parameter_value Sequencer_Monitor VOUT30_UVF 93.0
set_instance_parameter_value Sequencer_Monitor VOUT30_UVRSP true
set_instance_parameter_value Sequencer_Monitor VOUT30_UVW 97.0
set_instance_parameter_value Sequencer_Monitor VOUT31_OFF 90.0
set_instance_parameter_value Sequencer_Monitor VOUT31_ON 95.0
set_instance_parameter_value Sequencer_Monitor VOUT31_OVF 107.0
set_instance_parameter_value Sequencer_Monitor VOUT31_OVRSP true
set_instance_parameter_value Sequencer_Monitor VOUT31_OVW 105.0
set_instance_parameter_value Sequencer_Monitor VOUT31_TYP 1.5
set_instance_parameter_value Sequencer_Monitor VOUT31_UVF 93.0
set_instance_parameter_value Sequencer_Monitor VOUT31_UVRSP true
set_instance_parameter_value Sequencer_Monitor VOUT31_UVW 97.0
set_instance_parameter_value Sequencer_Monitor VOUT32_OFF 90.0
set_instance_parameter_value Sequencer_Monitor VOUT32_ON 95.0
set_instance_parameter_value Sequencer_Monitor VOUT32_OVF 107.0
set_instance_parameter_value Sequencer_Monitor VOUT32_OVRSP true
set_instance_parameter_value Sequencer_Monitor VOUT32_OVW 105.0
set_instance_parameter_value Sequencer_Monitor VOUT32_TYP 1.5
set_instance_parameter_value Sequencer_Monitor VOUT32_UVF 93.0
set_instance_parameter_value Sequencer_Monitor VOUT32_UVRSP true
set_instance_parameter_value Sequencer_Monitor VOUT32_UVW 97.0
set_instance_parameter_value Sequencer_Monitor VOUT33_OFF 90.0
set_instance_parameter_value Sequencer_Monitor VOUT33_ON 95.0
set_instance_parameter_value Sequencer_Monitor VOUT33_OVF 107.0
set_instance_parameter_value Sequencer_Monitor VOUT33_OVRSP true
set_instance_parameter_value Sequencer_Monitor VOUT33_OVW 105.0
set_instance_parameter_value Sequencer_Monitor VOUT33_TYP 1.5
set_instance_parameter_value Sequencer_Monitor VOUT33_UVF 93.0
set_instance_parameter_value Sequencer_Monitor VOUT33_UVRSP true
set_instance_parameter_value Sequencer_Monitor VOUT33_UVW 97.0
set_instance_parameter_value Sequencer_Monitor VOUT34_OFF 90.0
set_instance_parameter_value Sequencer_Monitor VOUT34_ON 95.0
set_instance_parameter_value Sequencer_Monitor VOUT34_OVF 107.0
set_instance_parameter_value Sequencer_Monitor VOUT34_OVRSP true
set_instance_parameter_value Sequencer_Monitor VOUT34_OVW 105.0
set_instance_parameter_value Sequencer_Monitor VOUT34_TYP 1.5
set_instance_parameter_value Sequencer_Monitor VOUT34_UVF 93.0
set_instance_parameter_value Sequencer_Monitor VOUT34_UVRSP true
set_instance_parameter_value Sequencer_Monitor VOUT34_UVW 97.0
set_instance_parameter_value Sequencer_Monitor VOUT35_OFF 90.0
set_instance_parameter_value Sequencer_Monitor VOUT35_ON 95.0
set_instance_parameter_value Sequencer_Monitor VOUT35_OVF 107.0
set_instance_parameter_value Sequencer_Monitor VOUT35_OVRSP true
set_instance_parameter_value Sequencer_Monitor VOUT35_OVW 105.0
set_instance_parameter_value Sequencer_Monitor VOUT35_TYP 1.5
set_instance_parameter_value Sequencer_Monitor VOUT35_UVF 93.0
set_instance_parameter_value Sequencer_Monitor VOUT35_UVRSP true
set_instance_parameter_value Sequencer_Monitor VOUT35_UVW 97.0
